# Altium project wius_hardware.PrjPcb
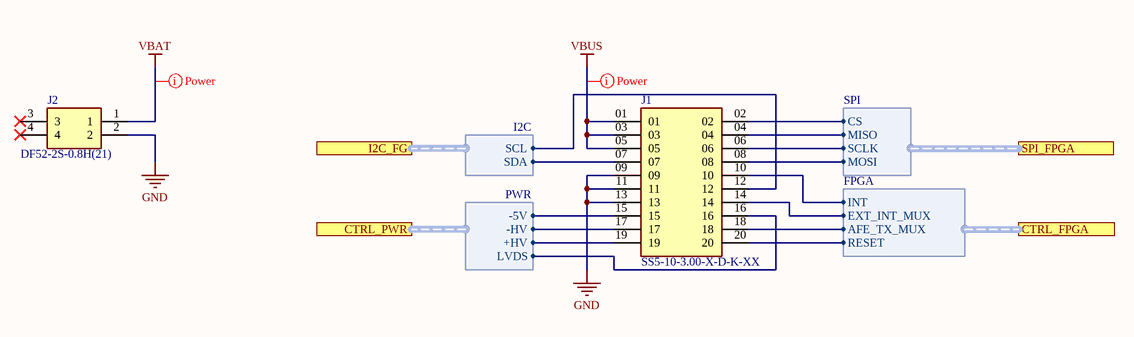
[diagram p0: connectors.SchDoc]
Desc1: High-Throughput, Low-Power WiFi for Wearable Ultrasound Systems; DrawnBy: Cédric Hirschi; FileInfo: =DocumentName; Organization: Integrated Systems Laboratory; ProjectTitle: WiUS; Revision: v1.0
7 sheets, 87 parts. Net scope: flat (ports and power ports of the same name join across sheets).
Board file: wius.PcbDoc
Sheets:
  connectors.SchDoc
  debug_interface.SchDoc
  gap.SchDoc
  power_conversion.SchDoc
  power_rf.SchDoc
  io_a.SchDoc
  io_b.SchDoc

## Sheet connectors.SchDoc: connectors
size A4; SheetNumber: 2; SheetTotal: 11

### Parts
J1  SS5-10-3.00-X-D-K-XX  [SAMTEC_SS5-10-3.00-X-D-K-XX]
J2  DF52-2S-0.8H(21)  [DF522S08H21]

### Ports
CTRL_FPGA (harness FPGA, see main[3B], power_io[5A]), CTRL_PWR (harness PWR, see main[3B], power_io[5A]), I2C_FG (harness I2C, see main[3B], io_b[4B], power_conversion[1A], power_io[6C]), SPI_FPGA (harness SPI, see main[3B], io_a[4C], power_io[6B])

### Harnesses
PWR: -5V, -HV, +HV, LVDS
FPGA: INT, EXT_INT_MUX, AFE_TX_MUX, RESET
SPI: CS, MISO, SCLK, MOSI
I2C: SCL, SDA

### Nets
GND: J1.09 J1.11 J1.13 J2.2
VBAT: J2.1
VBUS: J1.01 J1.03 J1.05
I2C_FG_SCL: J1.12 ; port I2C_FG.SCL
I2C_FG_SDA: J1.07 ; port I2C_FG.SDA
SPI_FPGA_SCLK_BUF: J1.06 ; port SPI_FPGA.SCLK
NetJ1_02: J1.02 ; port SPI_FPGA.CS
NetJ1_04: J1.04 ; port SPI_FPGA.MISO
NetJ1_08: J1.08 ; port SPI_FPGA.MOSI
NetJ1_10: J1.10 ; port CTRL_FPGA.INT
NetJ1_14: J1.14 ; port CTRL_FPGA.EXT_INT_MUX
NetJ1_15: J1.15 ; port CTRL_PWR.-5V
NetJ1_16: J1.16 ; port CTRL_PWR.LVDS
NetJ1_17: J1.17 ; port CTRL_PWR.-HV
NetJ1_18: J1.18 ; port CTRL_FPGA.AFE_TX_MUX
NetJ1_19: J1.19 ; port CTRL_PWR.+HV
NetJ1_20: J1.20 ; port CTRL_FPGA.RESET

Not connected (* = marked no-connect by the designer): J2 3* 4*

### Layout directives
net class Power: VBAT, VBUS

### Notes on the sheet
- Project:
- Laboratory:
- Date:
- File:
- Rev:
- Variation:
- Drawn By:
- Checked By:
- Sheet:
- /

### Library data of the parts
J1 = SS5-10-3.00-X-D-K-XX: 0.50mm Socket Strip Assembly; MF: Samtec Inc.; Availability: Unavailable; MP: SS5-10-3.00-X-D-K-XX; Price: None; Package: None; Value: *
J2 = DF52-2S-0.8H_21_: Connector; Manufacturer_Name: Hirose; Datasheet Link: https://datasheet.datasheetarchive.com/originals/distributors/DKDS-30/591726.pdf; Height: 1mm; Manufacturer_Part_Number: DF52-2S-0.8H(21); Mouser Part Number: 798-DF52-2S-0.8H21; Mouser Price/Stock: https://www.mouser.co.uk/ProductDetail/Hirose-Connector/DF52-2S-0.8H21?qs=%2FKR40Cd6GUpAHUMGMtWbig%3D%3D

## Sheet debug_interface.SchDoc: Debug interface
size A4; SheetNumber: 3; SheetTotal: 11
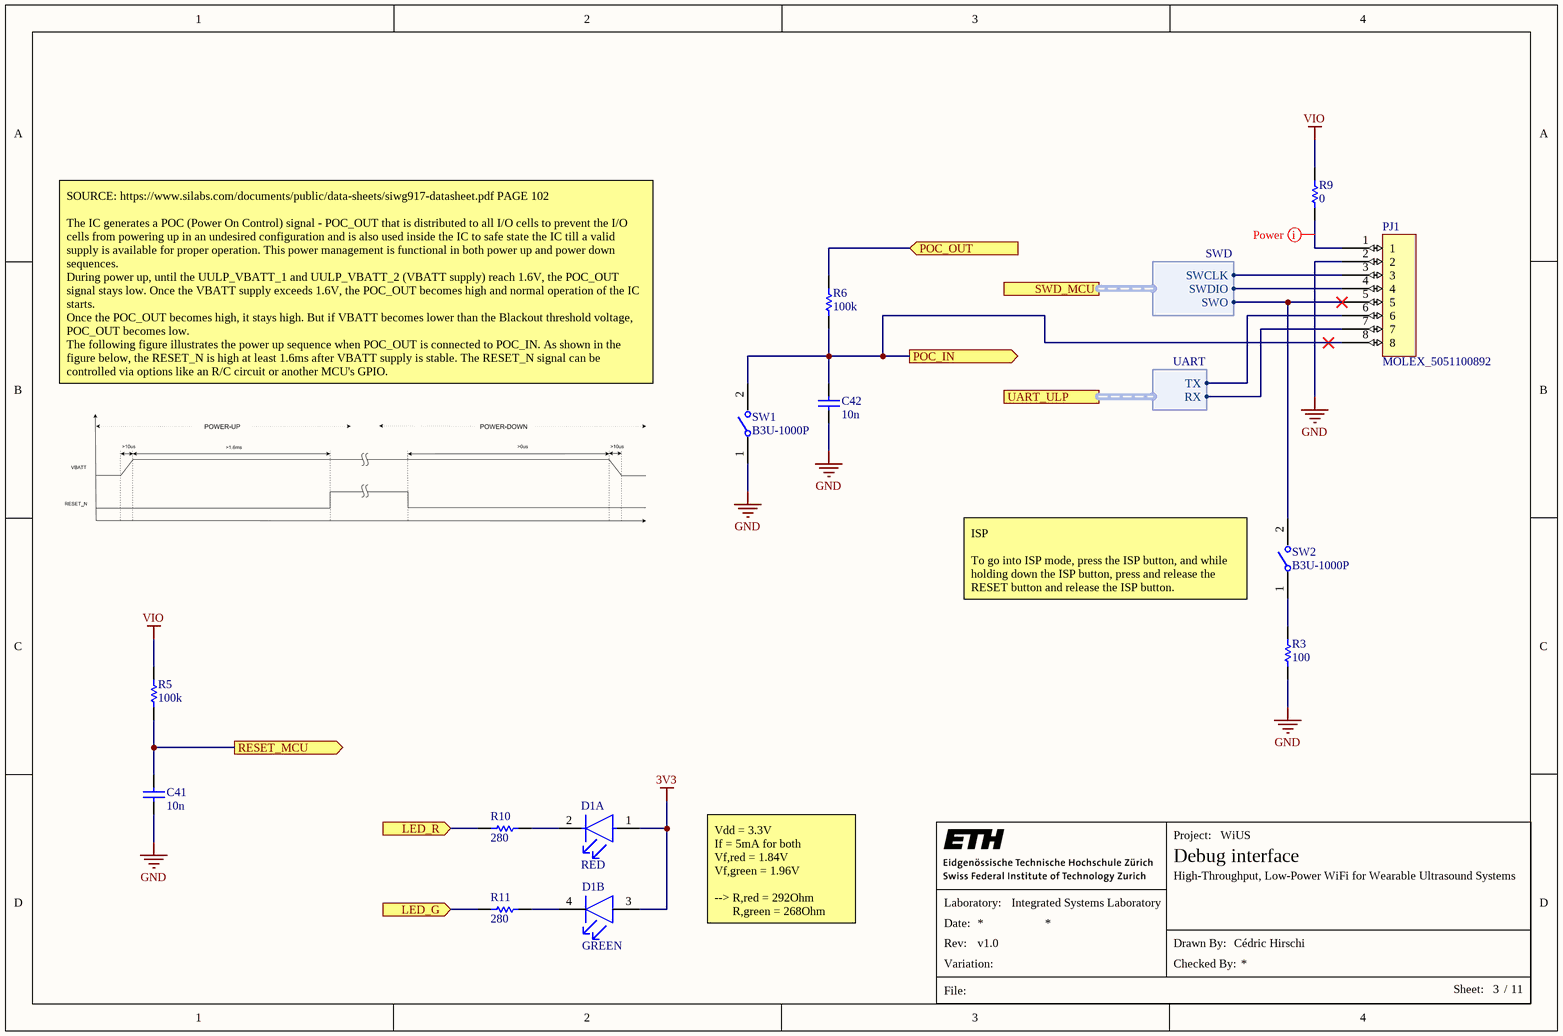
[diagram p1: debug_interface.SchDoc]

### Parts
C41  10n  [CAPC1005X55X25LL05T10]
C42  10n  [CAPC1005X55X25LL05T10]
D1  RED  [FP-APTB1615SURKCGKC-F01-MFG]  (parts A,B of 2)
PJ1  MOLEX_5051100892  [MOLEX_5051100892]
R3  100  [RESC1005X40X25ML05T10]
R5  100k  [RESC1005X40X25NL05T10]
R6  100k  [RESC1005X40X25NL05T10]
R9  value 0  [RESC1005X40X25ML05T10]  (hidden comment: Resistor 0R 0402 63 mW)
R10  280  [RESC1005X40X25NL05T10]
R11  280  [RESC1005X40X25NL05T10]
SW1  B3U-1000P  [FP-B3U-1000P-MFG]
SW2  B3U-1000P  [FP-B3U-1000P-MFG]

### Ports
LED_G (in, see main[3B], io_a[3A], power_io[6B]), LED_R (in, see main[3A], io_a[3A], power_io[6B]), POC_IN (out, see main[3A], power_core[1C], power_io[2B]), POC_OUT (in, see main[3A], power_core[1C], power_io[2B]), RESET_MCU (out, see main[3A], power_core[1C], power_io[2B]), SWD_MCU (harness SWD, see main[3A], io_b[4C], power_io[6C]), UART_ULP (harness UART, see main[3A], io_b[4C], power_io[6C])

### Harnesses
SWD: SWCLK, SWDIO, SWO
UART: RX, TX

### Nets
3V3: D1.1(RED_A) D1.3(GREEN_A)
GND: C41.2 C42.2 PJ1.2 R3.1 SW1.1
VIO: R5.2 R9.2
LED_G: R11.1 ; port LED_G
LED_R: R10.1 ; port LED_R
SWD_SWCLK: PJ1.3 ; port SWD_MCU.SWCLK
SWD_SWDIO: PJ1.4 ; port SWD_MCU.SWDIO
SWD_SWO: PJ1.5 SW2.2 ; port SWD_MCU.SWO
UART_ULP_RX: PJ1.7 ; port UART_ULP.RX
UART_ULP_TX: PJ1.6 ; port UART_ULP.TX
NetC41_1: C41.1 R5.1 ; port RESET_MCU
NetC42_1: C42.1 PJ1.8 R6.1 SW1.2 ; port POC_IN
NetD1_2: D1.2(RED_C) R10.2
NetD1_4: D1.4(GREEN_C) R11.2
NetPJ1_1: PJ1.1 R9.1
NetR3_2: R3.2 SW2.1
NetR6_2: R6.2 ; port POC_OUT

### Layout directives
net class Power: NetPJ1_1

### Notes on the sheet
- SOURCE: https://www.silabs.com/documents/public/data-sheets/siwg917-datasheet.pdf PAGE 102
  The IC generates a POC (Power On Control) signal - POC_OUT that is distributed to all I/O cells to prevent the I/O cells from powering up in an undesired configuration and is also used inside the IC to safe state the IC till a valid supply is available for proper operation. This power management is functional in both power up and power down sequences.
  During power up, until the UULP_VBATT_1 and UULP_VBATT_2 (VBATT supply) reach 1.6V, the POC_OUT signal stays low. Once the VBATT supply exceeds 1.6V, the POC_OUT becomes high and normal operation of the IC starts.
  Once the POC_OUT becomes high, it stays high. But if VBATT becomes lower than the Blackout threshold voltage, POC_OUT becomes low.
  The following figure illustrates the power up sequence when POC_OUT is connected to POC_IN. As shown in the figure below, the RESET_N is high at least 1.6ms after VBATT supply is stable. The RESET_N signal can be controlled via options like an R/C circuit or another MCU's GPIO.
- ISP
  To go into ISP mode, press the ISP button, and while holding down the ISP button, press and release the RESET button and release the ISP button.
- Vdd = 3.3V
  If = 5mA for both
  Vf,red = 1.84V
  Vf,green = 1.96V
  --> R,red = 292Ohm
  R,green = 268Ohm
- Project:
- Laboratory:
- Date:
- File:
- Rev:
- Variation:
- Drawn By:
- Checked By:
- Sheet:
- /

### Library data of the parts
C41 C42 = CMP-1034-01880-2: Manufacturer: Murata; Part Number: GRM155R71E103KA01D
D1 = CMP-44529-000005-1: LED GREEN/RED CLEAR CHIP SMD; Manufacturer: Kingbright; Manufacturer Part Number: APTB1615SURKCGKC-F01; Reverse Voltage: 5V; Viewing Angle: 150°; Max Junction Temp: +115°C; Led Orientation: Top View; Wavelength: 630/570nm; Colour: Red, Green; Forward Voltage: 1.95/2.1V; Peak Emmision Wavelength: 645/574nm; Power Dissipation: 75mW; Forward Current: 20mA; Luminous Intensity: 200/50mcd; Temperature Range High: +85°C; Temperature: -40°C to +85°C; Digikey Description: LED GREEN/RED CLEAR CHIP SMD; RoHS: TRUE; Automotive: No; Octopart: https://octopart.com/aptb1615surkcgkc-f01-kingbright-5355651; Temperature Range Low: -40°C; Device Class L3: unset; ComponentLink2Description: Datasheet; Device Class L1: Optoelectronics; Height: 0.9mm; ComponentLink2URL: http://www.kingbrightusa.com/images/catalog/SPEC/APTB1615SURKCGKC-F01.pdf; Category: Diode; Package: APTB1615SURKCGKC-F01; Device Class L2: LEDs; Lead Free: Yes
R3 = CMP-2002-07344-1: Part Number: RC0402FR-07100RL; Manufacturer: Yageo / Phycomp
R5 R6 = CMP-2002-07343-1: Part Number: RC0402FR-07100KL; Manufacturer: Yageo / Phycomp
R9 = CMP-009-00004-5: Chip Resistor, 0 Ohm, 0.063 W, -55 to 155 degC, 0402 (1005 Metric); Power: 63mW; Voltage Rating: 50V; Max Operating Temperature: 155°C; Pins: 2; RoHS Compliant: True; Min Operating Temperature: -55°C; Mounting Technology: SM; Case/Package: 0402
R10 R11 = CMP-1011-00446-2: Manufacturer: Yageo; Part Number: RC0402FR-07280RL
SW1 SW2 = CMP-2100-03586-2: SWITCH TACTILE SPST-NO 0.05A 12V; Contact Resistance: 100mR; Operating Force: 1.5N; Max Current Rating: 50mA; Switch Travel: 0.15mm; Actuator Type: Standard; Mechanical Life: 200000Cycles; Ratings: Dust Proof; Illumination Type: Non-Illuminated; Throw Configuration: SPST; Actuator Length: 0.4mm; Switch Function: Off-Mom; Height: 1.2mm; Width: 3mm; Weight: 0.000776oz; Contact Material: Silver; Max Voltage Rating (DC): 12V; Insulation Resistance: 100MR; Lead Free: Lead Free; Current Rating: 50mA; Termination: SMD/SMT; Length: 4mm; Voltage Rating (DC): 12V; Contact Current Rating: 50mA; Orientation: Straight; Depth: 2.5mm; Max Operating Temperature: 70°C; Packaging: Tape and Reel; Min Operating Temperature: -25°C; Package Quantity: 1; Mount: Surface Mount; Electrical Life: 200000Cycles

## Sheet gap.SchDoc: GAPMod
size A4; SheetNumber: 4; SheetTotal: 11
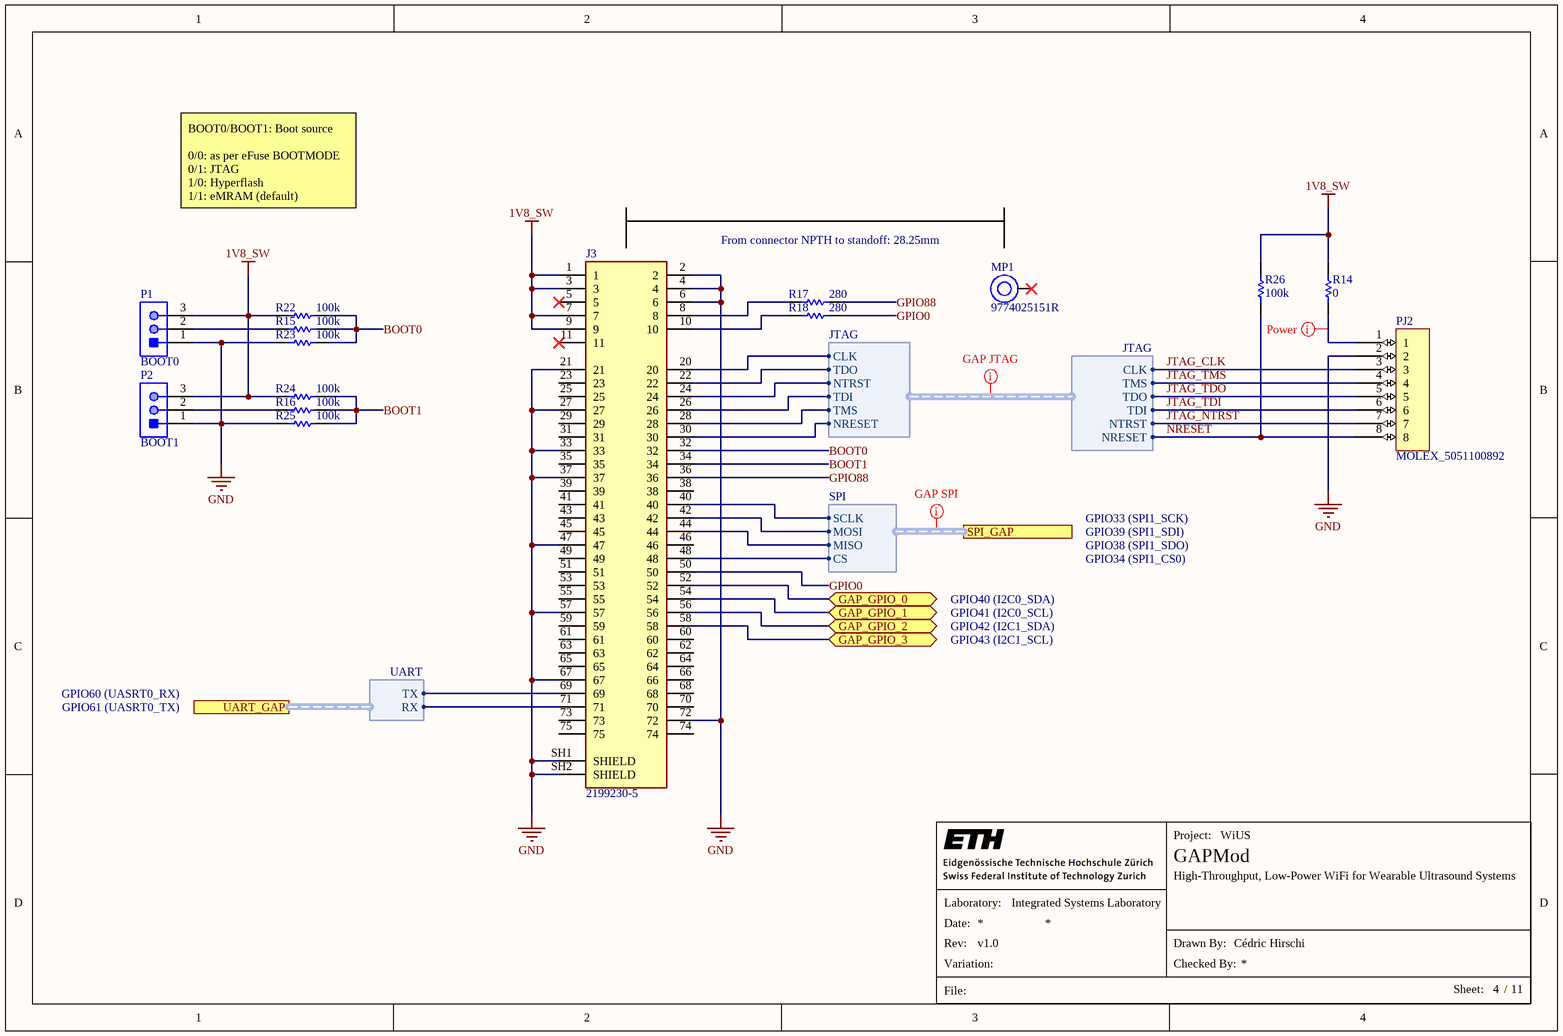
[diagram p2: gap.SchDoc]

### Parts
J3  2199230-5  [TE_2199230-5]
MP1  9774025151R  [9774025151]
P1  BOOT0  [SLIN-GRPB031VWVN-RC_V]
P2  BOOT1  [SLIN-GRPB031VWVN-RC_V]
PJ2  MOLEX_5051100892  [MOLEX_5051100892]
R14  value 0  [RESC1005X40X25ML05T10]  (hidden comment: Resistor 0R 0402 63 mW)
R15  100k  [RESC1005X40X25NL05T10]
R16  100k  [RESC1005X40X25NL05T10]
R17  280  [RESC1005X40X25NL05T10]
R18  280  [RESC1005X40X25NL05T10]
R22  100k  [RESC1005X40X25NL05T10]
R23  100k  [RESC1005X40X25NL05T10]
R24  100k  [RESC1005X40X25NL05T10]
R25  100k  [RESC1005X40X25NL05T10]
R26  100k  [RESC1005X40X25NL05T10]

### Ports
GAP_GPIO_0 (bidir, see main[6B], io_a[3B], power_io[6B]), GAP_GPIO_1 (bidir, see main[6B], io_a[3B], power_io[6B]), GAP_GPIO_2 (bidir, see main[6B], io_a[3B], power_io[6B]), GAP_GPIO_3 (bidir, see main[6B], io_a[3B], power_io[6B]), SPI_GAP (harness SPI, see main[6B], io_a[3B], power_io[6B]), UART_GAP (harness UART, see main[6B], io_a[3B], power_io[6B])

### Harnesses
SPI: SCLK, MISO, MOSI, CS
JTAG: CLK, TDO, NTRST, TDI, TMS, NRESET
UART: TX, RX

### Nets
1V8_SW: J3.1 J3.3 J3.7 J3.9 P1.3 P2.3 R14.2 R22.2 R24.2 R26.2
GND: J3.2 J3.4 J3.6 J3.21 J3.27 J3.33 J3.37 J3.47 J3.57 J3.67 J3.72 J3.SH1(SHIELD) J3.SH2(SHIELD) P1.1 P2.1 PJ2.2 R23.2 R25.2
BOOT0: J3.32 R15.1 R22.1 R23.1
BOOT1: J3.34 R16.1 R24.1 R25.1
GAP_GPIO_0: J3.52 ; port GAP_GPIO_0
GAP_GPIO_1: J3.54 ; port GAP_GPIO_1
GAP_GPIO_2: J3.56 ; port GAP_GPIO_2
GAP_GPIO_3: J3.58 ; port GAP_GPIO_3
GPIO0: J3.50 R18.2
GPIO88: J3.36 R17.2
JTAG_CLK: J3.20 PJ2.3 ; harness JTAG.CLK
JTAG_NTRST: J3.24 PJ2.7 ; harness JTAG.NTRST
JTAG_TDI: J3.26 PJ2.6 ; harness JTAG.TDI
JTAG_TDO: J3.22 PJ2.5 ; harness JTAG.TDO
JTAG_TMS: J3.28 PJ2.4 ; harness JTAG.TMS
NRESET: J3.30 PJ2.8 R26.1 ; harness JTAG.NRESET
SPI_GAP_CS: J3.48 ; port SPI_GAP.CS
SPI_GAP_MISO: J3.44 ; port SPI_GAP.MISO
SPI_GAP_MOSI: J3.42 ; port SPI_GAP.MOSI
SPI_GAP_SCLK: J3.40 ; port SPI_GAP.SCLK
UART_GAP_RX: J3.71 ; port UART_GAP.RX
UART_GAP_TX: J3.69 ; port UART_GAP.TX
NetJ3_8: J3.8 R17.1
NetJ3_10: J3.10 R18.1
NetP1_2: P1.2 R15.2
NetP2_2: P2.2 R16.2
NetPJ2_1: PJ2.1 R14.1

Not connected (* = marked no-connect by the designer): J3 5* 11* 23 25 29 31 35 38 39 41 43 45 46 49 51 53 55 59 60 61 62 63 64 65 66 68 70 73 74 75; MP1 1*

### Layout directives
net class Power: NetPJ2_1
net class JTAG_GAP: (no net found under the mark)
net class SPI_GAP: (no net found under the mark)

### Notes on the sheet
- BOOT0/BOOT1: Boot source
  0/0: as per eFuse BOOTMODE
  0/1: JTAG
  1/0: Hyperflash
  1/1: eMRAM (default)
- From connector NPTH to standoff: 28.25mm
- GPIO33 (SPI1_SCK)
- GPIO39 (SPI1_SDI)
- GPIO38 (SPI1_SDO)
- GPIO34 (SPI1_CS0)
- GPIO40 (I2C0_SDA)
- GPIO41 (I2C0_SCL)
- GPIO42 (I2C1_SDA)
- GPIO43 (I2C1_SCL)
- GPIO60 (UASRT0_RX)
- GPIO61 (UASRT0_TX)
- Project:
- Laboratory:
- Date:
- File:
- Rev:
- Variation:
- Drawn By:
- Checked By:
- Sheet:
- /

### Library data of the parts
J3 = 2199230-5: Conn Card Edge 67 POS 0.5mm Solder RA SMD Embossed T/R; MF: {'manufacturer': u'TE Connectivity'}; Package: None; Price: None; Value: *; MP: 2199230-5; Availability: Unavailable
MP1 = CMP-03913-59774856-1: 9774025151R Spacer Material: Steel Mounting: SMT Series: WA-SMSI Thread D: M2.5; Plating: Tin; Threaded/Unthreaded: Threaded; Outside Diameter: 5.1054mm; REACH SVHC: Unknown; Packaging: Tape and Reel; Height: 2.6mm; Min Operating Temperature: -55°C; NexarPartId: 59774856; Max Operating Temperature: 150°C; RoHS: Compliant; Length: 2.5mm; Material: Steel
P1 P2 = CMP-2000-06372-1: Male Header, Pitch 1.27 mm, 1 x 3 Position, Height 4 mm, Tail Length 2.3 mm, -40 to 105 degC, RoHS, Bulk; Manufacturer: Sullins; Other Names: S9014E-03; Number of Positions: 3; Connector Type: Header,Unshrouded; Pitch: 0.050"(1.27mm); Dynamic Catalog: GRPB; Catalog Drawings: S9014ESeriesTop; Mating Products: S9010E-03-ND / -CONNHEADER.050"3POSR/APCB / S9008E-03-ND / -CONNHEADER.050"3POSPCBGOLD / S9005E-03-ND / -CONNHEADER.050"3POSSMDGOLD; Number of Positions Loaded: All; Contact Finish: Gold; Mounting Type: ThroughHole; Termination: Solder; Packaging: Bulk; Category: Connectors,Interconnects; Package Description: Male Header, Pitch 1.27 mm, 1 x 3 Position, Height 4 mm, Tail Length 2.3 mm; Standard Package: 1; Datasheet URL: http://www.sullinscorp.com/drawings/71_GRPB___1VWVN-RC,_10957-C.pdf; Package Reference: GRPB031VWVN-RC; Family: RectangularConnectors-Headers,MalePins; Number of Rows: 1; Contact Type: MalePin; Manufacturer URL: http://www.sullinscorp.com/; Mounting Technology: ThroughHole; Contact Mating Length: 0.118"(3.00mm); Contact Finish Thickness: Flash; Datasheet Version: Rev. C, 12/2008
R14 = CMP-009-00004-5: as R9 on sheet debug_interface; Max Operating Temperature: 155°C; Pins: 2; RoHS Compliant: True; Min Operating Temperature: -55°C; Mounting Technology: SM; Case/Package: 0402
R15 R16 R22-R26 = CMP-2002-07343-1: as R5 on sheet debug_interface
R17 R18 = CMP-1011-00446-2: as R10 on sheet debug_interface

## Sheet power_conversion.SchDoc: Power conversion
size A4; SheetNumber: 5; SheetTotal: 11
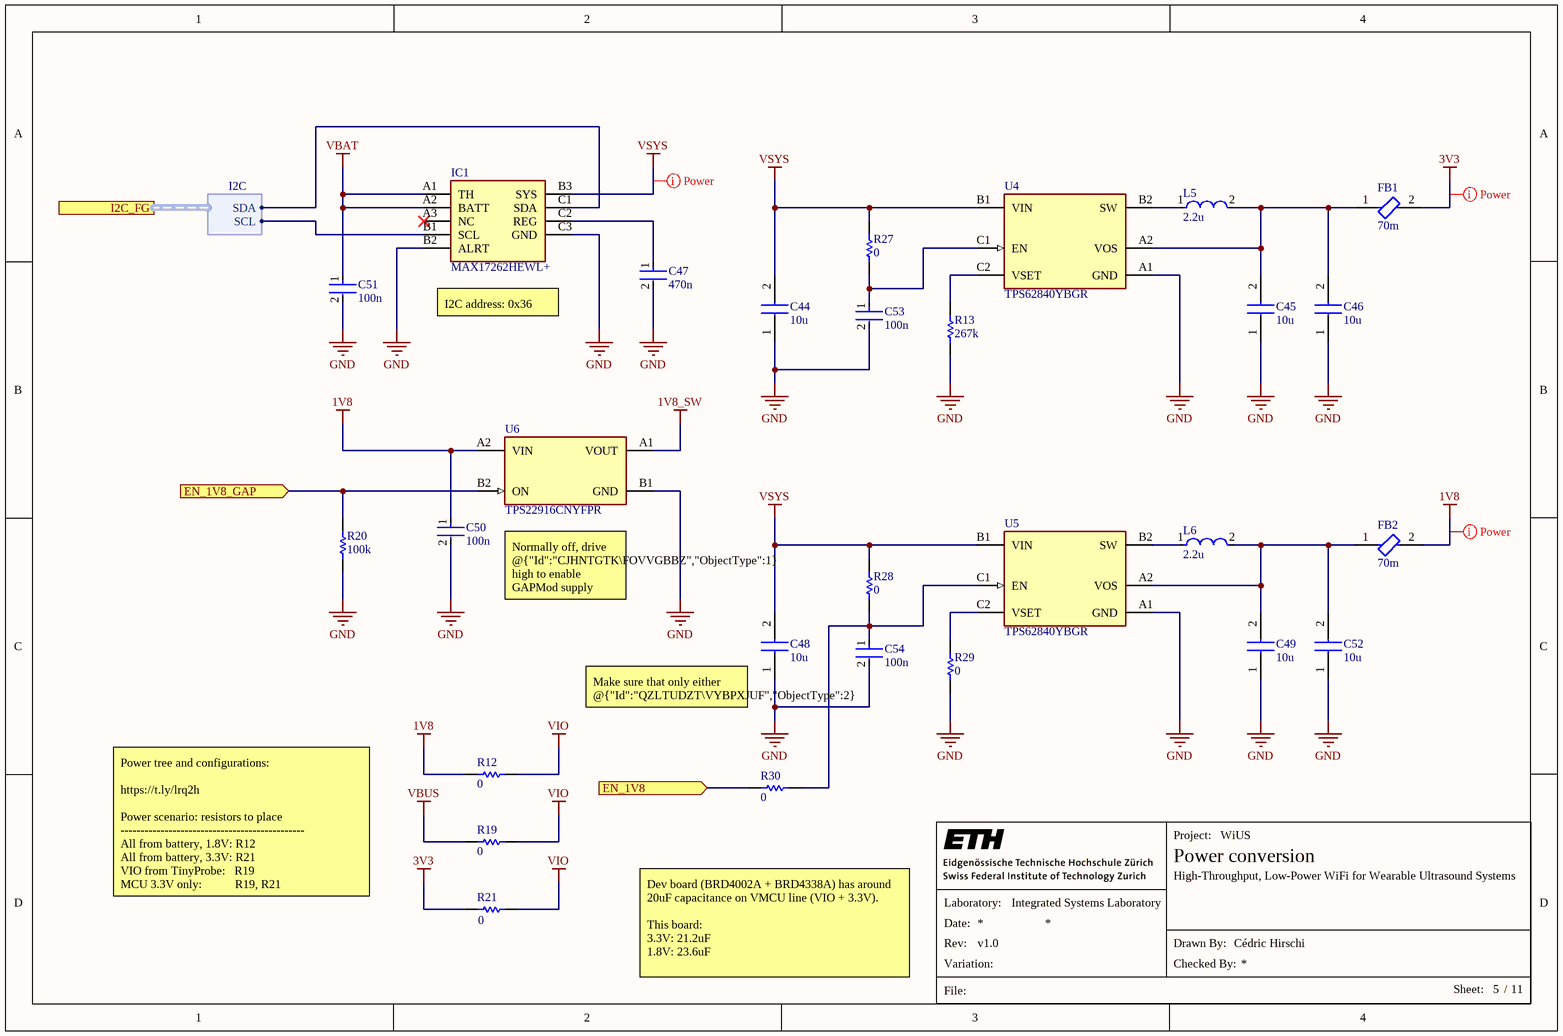
[diagram p3: power_conversion.SchDoc]

### Parts
C44  10u  [CAPC1608X100N]
C45  10u  [CAPC1608X100N]
C46  10u  [CAPC1608X100N]
C47  470n  [FP-GRM15-0_1-MFG]
C48  10u  [CAPC1608X100N]
C49  10u  [CAPC1608X100N]
C50  100n  [FP-GRT155-0_05-MFG]
C51  100n  [FP-GRT155-0_05-MFG]
C52  10u  [CAPC1608X100N]
C53  100n  [FP-GRT155-0_05-MFG]
C54  100n  [FP-GRT155-0_05-MFG]
FB1  70m  [FP-BLM15-0_05-MFG]
FB2  70m  [FP-BLM15-0_05-MFG]
IC1  MAX17262HEWL+  [BGA9C40P3X3_153X153X69]
L5  2.2u  [FP-DFE201612C-MFG]
L6  2.2u  [FP-DFE201612C-MFG]
R12  value 0  [RESC1005X40X25ML05T10]  (hidden comment: Resistor 0R 0402 63 mW)
R13  267k  [RESC1005X40X25LL05T10]
R19  value 0  [RESC1005X40X25ML05T10]  (hidden comment: Resistor 0R 0402 63 mW)
R20  100k  [RESC1005X40X25NL05T10]
R21  value 0  [RESC1005X40X25ML05T10]  (hidden comment: Resistor 0R 0402 63 mW)
R27  value 0  [RESC1005X40X25ML05T10]  (hidden comment: Resistor 0R 0402 63 mW)
R28  value 0  [RESC1005X40X25ML05T10]  (hidden comment: Resistor 0R 0402 63 mW)
R29  value 0  [RESC1005X40X25ML05T10]  (hidden comment: Resistor 0R 0402 63 mW)
R30  value 0  [RESC1005X40X25ML05T10]  (hidden comment: Resistor 0R 0402 63 mW)
U4  TPS62840YBGR  [FP-YBG0006-MFG]
U5  TPS62840YBGR  [FP-YBG0006-MFG]
U6  TPS22916CNYFPR  [FP-YFP0004-IPC_C]

### Ports
EN_1V8 (in, see main[4C], io_a[3B], power_io[6B]), EN_1V8_GAP (in, see main[4C], io_a[3B], power_io[6B]), I2C_FG (harness I2C, see main[4C], connectors[2B], io_b[4B], power_io[6C])

### Harnesses
I2C: SDA, SCL

### Nets
1V8: C50.1 FB2.2 R12.2 U6.A2(VIN)
1V8_SW: U6.A1(VOUT)
3V3: FB1.2 R21.1
GND: C44.1 C45.1 C46.1 C47.2 C48.1 C49.1 C50.2 C51.2 C52.1 C53.2 C54.2 IC1.B2(ALRT) IC1.C3(GND) R13.1 R20.1 R29.2 U4.A1(GND) U5.A1(GND) U6.B1(GND)
VBAT: C51.1 IC1.A1(TH) IC1.A2(BATT)
VBUS: R19.2
VIO: R12.1 R19.1 R21.2
VSYS: C44.2 C48.2 IC1.B3(SYS) R27.1 R28.1 U4.B1(VIN) U5.B1(VIN)
EN_1V8: R30.1 ; port EN_1V8
EN_1V8_GAP: R20.2 U6.B2(ON) ; port EN_1V8_GAP
I2C_FG_SCL: IC1.B1(SCL) ; port I2C_FG.SCL
I2C_FG_SDA: IC1.C1(SDA) ; port I2C_FG.SDA
NetC45_2: C45.2 C46.2 FB1.1 L5.2 U4.A2(VOS)
NetC47_1: C47.1 IC1.C2(REG)
NetC49_2: C49.2 C52.2 FB2.1 L6.2 U5.A2(VOS)
NetC53_1: C53.1 R27.2 U4.C1(EN)
NetC54_1: C54.1 R28.2 R30.2 U5.C1(EN)
NetL5_1: L5.1 U4.B2(SW)
NetL6_1: L6.1 U5.B2(SW)
NetR13_2: R13.2 U4.C2(VSET)
NetR29_1: R29.1 U5.C2(VSET)

Not connected (* = marked no-connect by the designer): IC1 A3(NC)*

### Layout directives
net class Power: 1V8, 3V3, VSYS

### Notes on the sheet
- (near IC1) I2C address: 0x36
- Normally off, drive @{"Id":"CJHNTGTK\FOVVGBBZ","ObjectType":1} high to enable GAPMod supply
- (near C48) Make sure that only either @{"Id":"QZLTUDZT\VYBPXJUF","ObjectType":2} or @{"Id":"QZLTUDZT\XKOCDFZE","ObjectType":2} is mounted
- Power tree and configurations:
  https://t.ly/lrq2h
  Power scenario: resistors to place
  ----------------------------------------------
  All from battery, 1.8V: R12
  All from battery, 3.3V: R21
  VIO from TinyProbe:   R19
  MCU 3.3V only:           R19, R21
- Dev board (BRD4002A + BRD4338A) has around 20uF capacitance on VMCU line (VIO + 3.3V).
  This board:
  3.3V: 21.2uF
  1.8V: 23.6uF
- Project:
- Laboratory:
- Date:
- File:
- Rev:
- Variation:
- Drawn By:
- Checked By:
- Sheet:
- /

### Library data of the parts
C44-C46 C48 C49 C52 = GMC10X7R106K10NT: Cap Cer 10UF 10V X7R 0603; Manufacturer_Name: Cal-Chip; Datasheet Link: https://88ce57.p3cdn1.secureserver.net/wp-content/uploads/2023/01/gmc_series-2.pdf; Height: 1mm; Manufacturer_Part_Number: GMC10X7R106K10NT; Supplier 1: Digikey; Supplier Part Number 1: 4713-GMC10X7R106K10NTCT-ND
C47 = CMP-2000-05009-2: CAP CER 0.47UF 10V X5R 0402; Manufacturer: Murata Electronics North America; Manufacturer Part Number: GRM155R61A474KE15D; Temperature Coefficient: 15%; Material: Ceramic; Tolerance: 10%; Device Class L3: Ceramic Capacitors; ComponentLink2Description: Datasheet; ComponentLink2URL: https://search.murata.co.jp/Ceramy/image/img/A01X/G101/ENG/GRM155R61A474KE15-01A.pdf; Package: GRM15-0.1; Voltage Rating: 10V; Capacitance: 0.47uF; Category: Cap; Temperature Range High: +85°C; Temperature Range Low: -55°C; Height: 0.55mm; Device Class L2: Capacitors; Lead Free: Yes; Mouser Description: Multilayer Ceramic Capacitors MLCC - SMD/SMT 0402 0.47uF 10volts X5R 10%; Ipc Land Pattern Name: CAPC10050X50; Temperature Characteristic: X5R; Digikey Description: CAP CER 0.47UF 10V X5R 0402; Value: 0.47uF; Octopart: https://octopart.com/grm155r61a474ke15d-murata-196883; Automotive: No; Device Class L1: Passive Components; Temperature: -55°C to +85°C; RoHS: TRUE
C50 C51 C53 C54 = CMP-06035-014200-1: Multi-Layer Ceramic Capacitor 100nF 50V X7R ±10% 0402 Paper T/R
FB1 FB2 = CMP-0686-00284-4: Chip Ferrite Bead, 0402, 80Ω @ 100MHz, 0.07Ω, 25%, 1.5A; Number of Lines: 1; DC Resistance-Max: 70mR; Impedance: 80R; Height: 0.5mm; Package Quantity: 1; RoHS Compliant: Yes; Max Operating Temperature: 125°C; Depth: 0.5mm; Max Current Rating: 1.5A; Max DC Current: 1.5A; Current Rating: 1.5A; Number of Pins: 2; Case Code (Imperial): 0402; Case/Package: 0402; Case Code (Metric): 1005; Material: Ferrite; Packaging: Tape and Reel; REACH SVHC: No SVHC; Length: 1mm; Tolerance: 25%; Termination: SMD/SMT; Series: BLM15PD; Number of Circuits: 1; Test Frequency: 100MHz; DC Resistance (DCR): 70mR; Min Operating Temperature: -55°C; Lead Free: Lead Free; Width: 0.5mm
IC1 = MAX17262HEWL+: Integrated Circuit; Manufacturer_Name: Analog Devices; Datasheet Link: https://www.analog.com/MAX17262/datasheet; Height: 0.69mm; Manufacturer_Part_Number: MAX17262HEWL+
L5 L6 = CMP-06042-009962-1: Shielded Wirewound Inductor 2.2uH 20% 1800mA 0.116Ω 0806 (2016)
R12 R19 R21 R27-R30 = CMP-009-00004-5: as R9 on sheet debug_interface; Max Operating Temperature: 155°C; Pins: 2; RoHS Compliant: True; Min Operating Temperature: -55°C; Mounting Technology: SM; Case/Package: 0402
R13 = CMP-2002-07544-1: Manufacturer: Yageo; Part Number: RC0402FR-07267KL
R20 = CMP-2002-07343-1: as R5 on sheet debug_interface
U4 U5 = CMP-04918-000401-1: ULTRA LOW IQ BUCK CONVERTER
U6 = CMP-04910-000105-1: IC PWR SWITCH P-CHAN 1:1 4DSBGA; Max Output Current: 2A; Number of Outputs: 1; Fault Protection: Reverse Current; Output Configuration: High Side; RoHS Compliant: Yes; Min Operating Temperature: -40°C; Packaging: Cut Tape; Number of Channels: 1; Max Operating Temperature: 85°C

## Sheet power_rf.SchDoc: RF power conversion
size A4; SheetNumber: 8; SheetTotal: 11
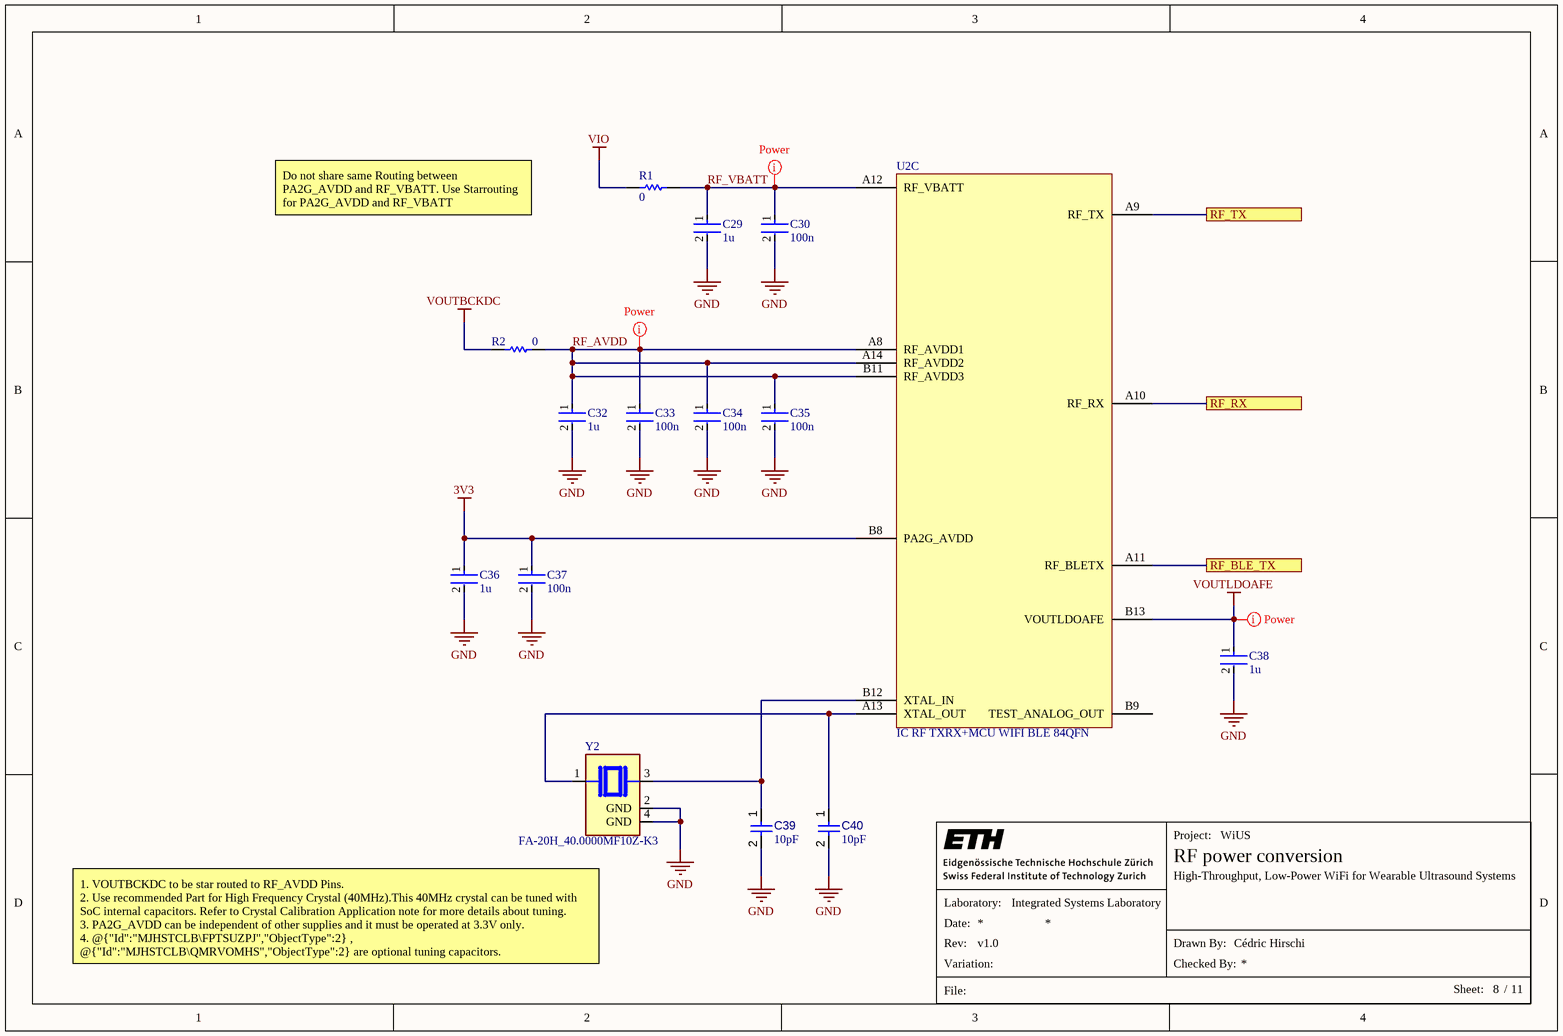
[diagram p4: power_rf.SchDoc]

### Parts
C29  1u  [FP-GRM155-0_05-MFG]
C30  100n  [FP-GRT155-0_05-MFG]
C32  1u  [FP-GRM155-0_05-MFG]
C33  100n  [FP-GRT155-0_05-MFG]
C34  100n  [FP-GRT155-0_05-MFG]
C35  100n  [FP-GRT155-0_05-MFG]
C36  1u  [FP-GRM155-0_05-MFG]
C37  100n  [FP-GRT155-0_05-MFG]
C38  1u  [FP-GRM155-0_05-MFG]
C39  value 10pF  [CAPC1005X55X30LL05T10]  (hidden comment: Capacitor 10 pF +/- 0.25 pF 50 V 0402)
C40  value 10pF  [CAPC1005X55X30LL05T10]  (hidden comment: Capacitor 10 pF +/- 0.25 pF 50 V 0402)
R1  value 0  [RESC1005X40X25ML05T10]  (hidden comment: Resistor 0R 0402 63 mW)
R2  value 0  [RESC1005X40X25ML05T10]  (hidden comment: Resistor 0R 0402 63 mW)
U2  IC RF TXRX+MCU WIFI BLE 84QFN  [SIWG917M110LGTBA]  (part C of 4)
Y2  FA-20H_40.0000MF10Z-K3  [XTAL_FA-20H_40.0000MF10Z-K3]

### Ports
RF_BLE_TX (see power_io[3C], power_io[2C], rf_clocks[4A]), RF_RX (see power_io[3C], power_io[2C], rf_clocks[4B]), RF_TX (see power_io[3C], power_io[2C], rf_clocks[4B])

### Nets
3V3: C36.1 C37.1 U2.B8(PA2G_AVDD)
GND: C29.2 C30.2 C32.2 C33.2 C34.2 C35.2 C36.2 C37.2 C38.2 C39.2 C40.2 Y2.2(GND) Y2.4(GND)
VIO: R1.1
VOUTBCKDC: R2.1
VOUTLDOAFE: C38.1 U2.B13(VOUTLDOAFE)
RF_AVDD: C32.1 C33.1 C34.1 C35.1 R2.2 U2.A8(RF_AVDD1) U2.A14(RF_AVDD2) U2.B11(RF_AVDD3)
RF_VBATT: C29.1 C30.1 R1.2 U2.A12(RF_VBATT)
NetC39_1: C39.1 U2.B12(XTAL_IN) Y2.3
NetC40_1: C40.1 U2.A13(XTAL_OUT) Y2.1
NetU2_A9: U2.A9(RF_TX) ; port RF_TX
NetU2_A10: U2.A10(RF_RX) ; port RF_RX
NetU2_A11: U2.A11(RF_BLETX) ; port RF_BLE_TX

Not connected (* = marked no-connect by the designer): U2 B9(TEST_ANALOG_OUT)

### Layout directives
net class Power: RF_AVDD, RF_VBATT, VOUTLDOAFE

### Notes on the sheet
- Do not share same Routing between PA2G_AVDD and RF_VBATT. Use Starrouting for PA2G_AVDD and RF_VBATT
- (near Y2) 1. VOUTBCKDC to be star routed to RF_AVDD Pins.
  2. Use recommended Part for High Frequency Crystal (40MHz).This 40MHz crystal can be tuned with SoC internal capacitors. Refer to Crystal Calibration Application note for more details about tuning.
  3. PA2G_AVDD can be independent of other supplies and it must be operated at 3.3V only.
  4. @{"Id":"MJHSTCLB\FPTSUZPJ","ObjectType":2} , @{"Id":"MJHSTCLB\QMRVOMHS","ObjectType":2} are optional tuning capacitors.
  5. @{"Id":"MJHSTCLB\IOXMTIAC","ObjectType":2} , @{"Id":"MJHSTCLB\BRJDNKUM","ObjectType":2} are placeholder components for power supply noise filtering purpose.
- Project:
- Laboratory:
- Date:
- File:
- Rev:
- Variation:
- Drawn By:
- Checked By:
- Sheet:
- /

### Library data of the parts
C29 C32 C36 C38 = CMP-06035-025126-1: Chip Multilayer Ceramic Capacitors for General Purpose, 0402, 1.0uF, X6S, 22%, 10%, 16V; Capacitance: 1uF; Thickness: 500um; Voltage Rating (DC): 16V; Tolerance: 10%; Width: 500um; Length: 1mm; Dielectric: X6S
C30 C33-C35 C37 = CMP-06035-014200-1: as C50 on sheet power_conversion
C39 C40 = CMP-001-00011-6: Chip Capacitor, 10 pF, +/- 0.25 pF, 50 V, 0402 (1005 Metric); Voltage Rating: 50V; Tolerance: 0.25%; Capacitor Type: Ceramic; Mounting Technology: SM; Pins: 2; Case/Package: 0402; Min Operating Temperature: -55°C; RoHS Compliant: True; Max Operating Temperature: 125°C
R1 R2 = CMP-009-00004-5: as R9 on sheet debug_interface; Max Operating Temperature: 155°C; Pins: 2; RoHS Compliant: True; Min Operating Temperature: -55°C; Mounting Technology: SM; Case/Package: 0402
U2 = SIWG917
Y2 = FA-20H_40.0000MF10Z-K3: MF: {'manufacturer': u'EPSON'}; MP: FA-20H 40.0000MF10Z-K3; Package: None; Price: None; Value: *; Availability: Unavailable; Supplier 1: Future Electronics; Supplier Part Number 1: 6169727

## Sheet io_a.SchDoc: I/O bank A
size A4; SheetNumber: 9; SheetTotal: 11
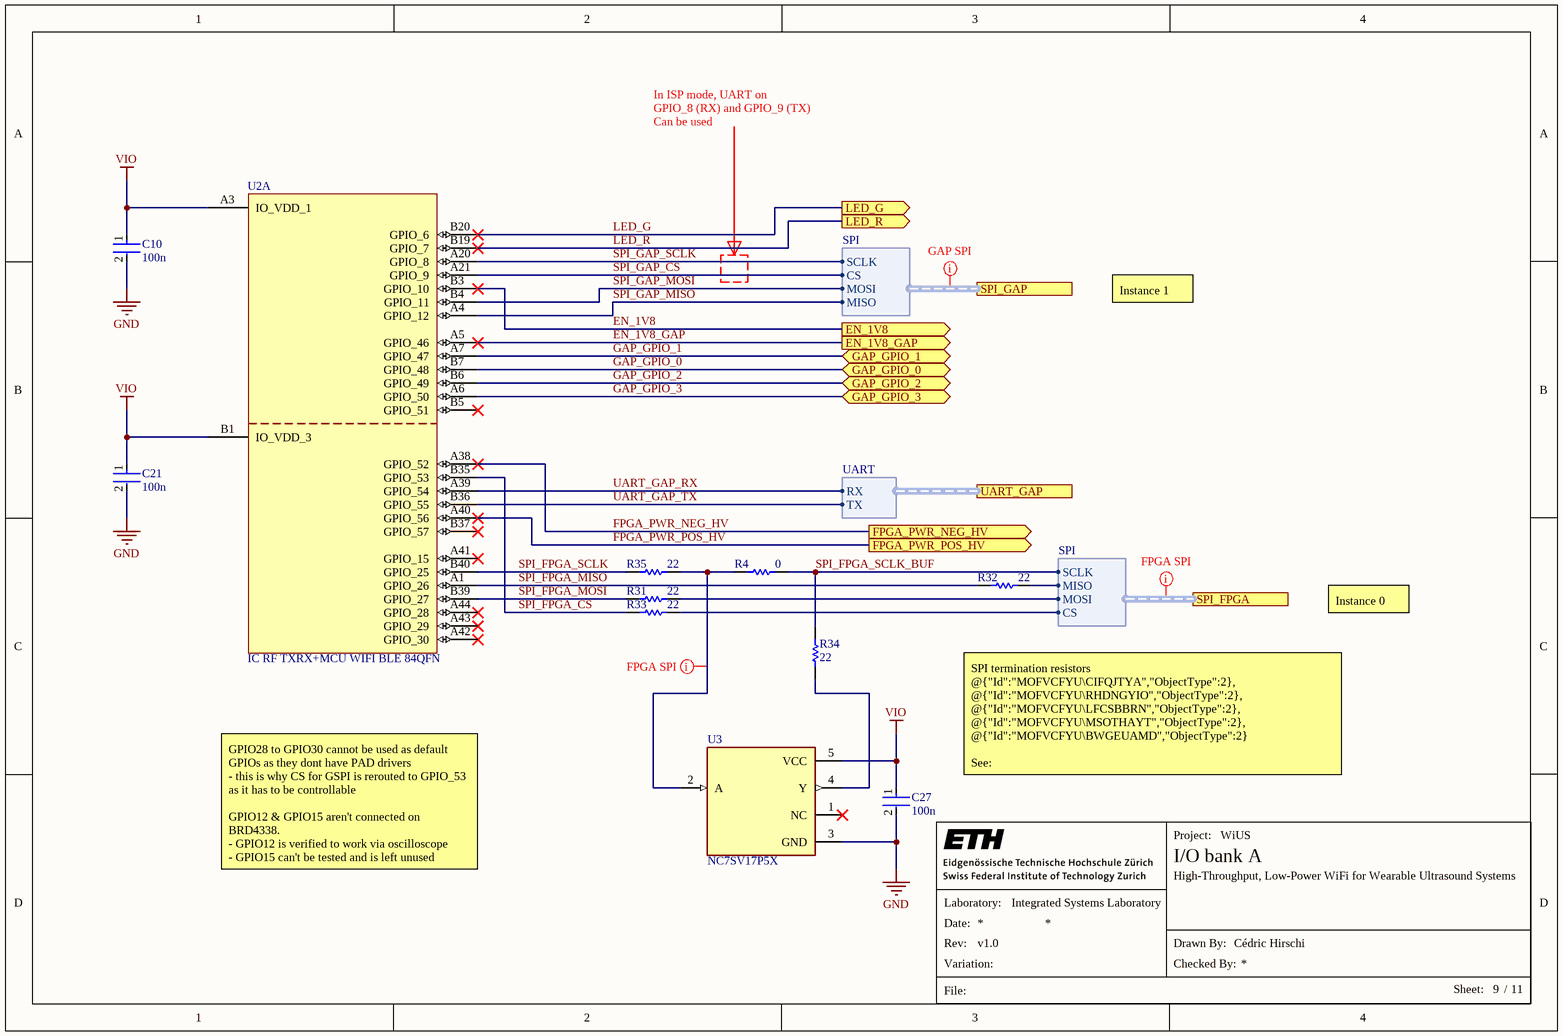
[diagram p5: io_a.SchDoc]

### Parts
C10  100n  [FP-GRT155-0_05-MFG]
C21  100n  [FP-GRT155-0_05-MFG]
C27  100n  [FP-GRT155-0_05-MFG]
R4  value 0  [RESC1005X40X25ML05T10]  (hidden comment: Resistor 0R 0402 63 mW)
R31  22  [RESC1005X40X25LL05T10]
R32  22  [RESC1005X40X25LL05T10]
R33  22  [RESC1005X40X25LL05T10]
R34  22  [RESC1005X40X25LL05T10]
R35  22  [RESC1005X40X25LL05T10]
U2  IC RF TXRX+MCU WIFI BLE 84QFN  [SIWG917M110LGTBA]  (part A of 4)
U3  NC7SV17P5X  [SOT65P210X110-5N]

### Ports
EN_1V8 (out, see power_io[6B], power_conversion[2D], power_io[6B]), EN_1V8_GAP (out, see power_io[6B], power_conversion[1B], power_io[6B]), FPGA_PWR_NEG_HV (out, see power_io[6B]), FPGA_PWR_POS_HV (out, see power_io[6B]), GAP_GPIO_0 (bidir, see power_io[6B], gap[3C], power_io[6B]), GAP_GPIO_1 (bidir, see power_io[6B], gap[3C], power_io[6B]), GAP_GPIO_2 (bidir, see power_io[6B], gap[3C], power_io[6B]), GAP_GPIO_3 (bidir, see power_io[6B], gap[3C], power_io[6B]), LED_G (out, see power_io[6B], debug_interface[1D], power_io[6B]), LED_R (out, see power_io[6B], debug_interface[1D], power_io[6B]), SPI_FPGA (harness SPI, see power_io[6B], connectors[4B], power_io[6B]), SPI_GAP (harness SPI, see power_io[6B], gap[3C], power_io[6B]), UART_GAP (harness UART, see power_io[6B], gap[1C], power_io[6B])

### Harnesses
SPI: SCLK, MISO, MOSI, CS
UART: TX, RX

### Nets
GND: C10.2 C21.2 C27.2 U3.3(GND)
VIO: C10.1 C21.1 C27.1 U2.A3(IO_VDD_1) U2.B1(IO_VDD_3) U3.5(VCC)
EN_1V8: U2.B3(GPIO_10) ; port EN_1V8
EN_1V8_GAP: U2.A5(GPIO_46) ; port EN_1V8_GAP
FPGA_PWR_NEG_HV: U2.A38(GPIO_52) ; port FPGA_PWR_NEG_HV
FPGA_PWR_POS_HV: U2.A40(GPIO_56) ; port FPGA_PWR_POS_HV
GAP_GPIO_0: U2.B7(GPIO_48) ; port GAP_GPIO_0
GAP_GPIO_1: U2.A7(GPIO_47) ; port GAP_GPIO_1
GAP_GPIO_2: U2.B6(GPIO_49) ; port GAP_GPIO_2
GAP_GPIO_3: U2.A6(GPIO_50) ; port GAP_GPIO_3
LED_G: U2.B20(GPIO_6) ; port LED_G
LED_R: U2.B19(GPIO_7) ; port LED_R
SPI_FPGA_CS: R33.1 U2.B35(GPIO_53)
SPI_FPGA_MISO: R32.1 U2.A1(GPIO_26)
SPI_FPGA_MOSI: R31.1 U2.B39(GPIO_27)
SPI_FPGA_SCLK: R35.1 U2.B40(GPIO_25)
SPI_FPGA_SCLK_BUF: R4.2 R34.2 ; port SPI_FPGA.SCLK
SPI_GAP_CS: U2.A21(GPIO_9) ; port SPI_GAP.CS
SPI_GAP_MISO: U2.A4(GPIO_12) ; port SPI_GAP.MISO
SPI_GAP_MOSI: U2.B4(GPIO_11) ; port SPI_GAP.MOSI
SPI_GAP_SCLK: U2.A20(GPIO_8) ; port SPI_GAP.SCLK
UART_GAP_RX: U2.A39(GPIO_54) ; port UART_GAP.RX
UART_GAP_TX: U2.B36(GPIO_55) ; port UART_GAP.TX
NetJ1_02: R33.2 ; port SPI_FPGA.CS
NetJ1_04: R32.2 ; port SPI_FPGA.MISO
NetJ1_08: R31.2 ; port SPI_FPGA.MOSI
NetR4_1: R4.1 R35.2 U3.2(A)
NetR34_1: R34.1 U3.4(Y)

Not connected (* = marked no-connect by the designer): U2 A41(GPIO_15)* A42(GPIO_30)* A43(GPIO_29)* A44(GPIO_28)* B5(GPIO_51)* B37(GPIO_57)*; U3 1(NC)*

### Layout directives
net class SPI_GAP: (no net found under the mark)
net class SPI_FPGA: (no net found under the mark), NetR4_1

### Notes on the sheet
- In ISP mode, UART on
  GPIO_8 (RX) and GPIO_9 (TX)
  Can be used
- Instance 1
- Instance 0
- SPI termination resistors @{"Id":"MOFVCFYU\CIFQJTYA","ObjectType":2}, @{"Id":"MOFVCFYU\RHDNGYIO","ObjectType":2}, @{"Id":"MOFVCFYU\LFCSBBRN","ObjectType":2}, @{"Id":"MOFVCFYU\MSOTHAYT","ObjectType":2}, @{"Id":"MOFVCFYU\BWGEUAMD","ObjectType":2}
  See: https://resources.altium.com/de/p/there-spi-trace-impedance-requirement
  Place master resistors @{"Id":"MOFVCFYU\CIFQJTYA","ObjectType":2}, @{"Id":"MOFVCFYU\LFCSBBRN","ObjectType":2}, @{"Id":"MOFVCFYU\BWGEUAMD","ObjectType":2} close to the SOC
  Place slave resistor @{"Id":"MOFVCFYU\RHDNGYIO","ObjectType":2} close to the connector
  Place clock buffer resistor @{"Id":"MOFVCFYU\MSOTHAYT","ObjectType":2} close to the buffer
- GPIO28 to GPIO30 cannot be used as default GPIOs as they dont have PAD drivers
  - this is why CS for GSPI is rerouted to GPIO_53 as it has to be controllable
  GPIO12 & GPIO15 aren't connected on BRD4338.
  - GPIO12 is verified to work via oscilloscope
  - GPIO15 can't be tested and is left unused
- Project:
- Laboratory:
- Date:
- File:
- Rev:
- Variation:
- Drawn By:
- Checked By:
- Sheet:
- /

### Library data of the parts
C10 C21 C27 = CMP-06035-014200-1: as C50 on sheet power_conversion
R4 = CMP-009-00004-5: as R9 on sheet debug_interface; Max Operating Temperature: 155°C; Pins: 2; RoHS Compliant: True; Min Operating Temperature: -55°C; Mounting Technology: SM; Case/Package: 0402
R31-R35 = CMP-2002-07520-1: Manufacturer: Yageo / Phycomp; Part Number: RC0402FR-0722RL
U2 = SIWG917
U3 = NC7SV17P5X: Buffer, Non-Inverting 1 Element 1 Bit per Element Push-Pull Output SC-70-5; MF: {'manufacturer': u'ON Semiconductor'}; Package: None; Price: None; Value: *; MP: NC7SV17P5X; Availability: Unavailable

## Sheet io_b.SchDoc: I/O bank B
size A4; SheetNumber: 10; SheetTotal: 11
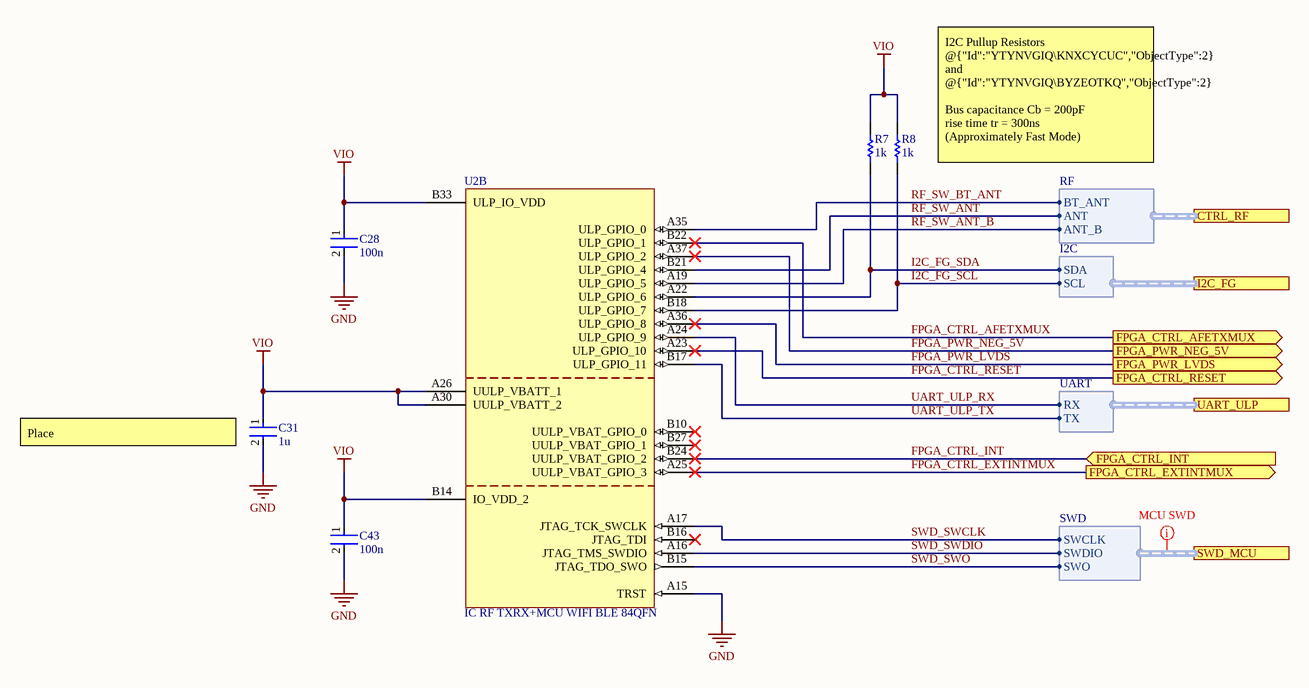
[diagram p6: io_b.SchDoc]

### Parts
C28  100n  [FP-GRT155-0_05-MFG]
C31  1u  [FP-GRM155-0_05-MFG]
C43  100n  [FP-GRT155-0_05-MFG]
R7  1k  [RESC1005X40X25LL05T10]
R8  1k  [RESC1005X40X25LL05T10]
U2  IC RF TXRX+MCU WIFI BLE 84QFN  [SIWG917M110LGTBA]  (part B of 4)

### Ports
CTRL_RF (harness RF, see power_io[6C], rf_clocks[1C]), FPGA_CTRL_AFETXMUX (out, see power_io[6C]), FPGA_CTRL_EXTINTMUX (out, see power_io[6C]), FPGA_CTRL_INT (in, see power_io[6C]), FPGA_CTRL_RESET (out, see power_io[6C]), FPGA_PWR_LVDS (out, see power_io[6C]), FPGA_PWR_NEG_5V (out, see power_io[6C]), I2C_FG (harness I2C, see power_io[6C], connectors[2B], power_conversion[1A], power_io[6C]), SWD_MCU (harness SWD, see power_io[6C], debug_interface[3B], power_io[6C]), UART_ULP (harness UART, see power_io[6C], debug_interface[3B], power_io[6C])

### Harnesses
I2C: SDA, SCL
RF: BT_ANT, ANT, ANT_B
UART: RX, TX
SWD: SWCLK, SWDIO, SWO

### Nets
GND: C28.2 C31.2 C43.2 U2.A15(TRST)
VIO: C28.1 C31.1 C43.1 R7.2 R8.2 U2.A26(UULP_VBATT_1) U2.A30(UULP_VBATT_2) U2.B14(IO_VDD_2) U2.B33(ULP_IO_VDD)
FPGA_CTRL_AFETXMUX: U2.B22(ULP_GPIO_1) ; port FPGA_CTRL_AFETXMUX
FPGA_CTRL_EXTINTMUX: U2.A25(UULP_VBAT_GPIO_3) ; port FPGA_CTRL_EXTINTMUX
FPGA_CTRL_INT: U2.B24(UULP_VBAT_GPIO_2) ; port FPGA_CTRL_INT
FPGA_CTRL_RESET: U2.A23(ULP_GPIO_10) ; port FPGA_CTRL_RESET
FPGA_PWR_LVDS: U2.A36(ULP_GPIO_8) ; port FPGA_PWR_LVDS
FPGA_PWR_NEG_5V: U2.A37(ULP_GPIO_2) ; port FPGA_PWR_NEG_5V
I2C_FG_SCL: R8.1 U2.B18(ULP_GPIO_7) ; port I2C_FG.SCL
I2C_FG_SDA: R7.1 U2.A22(ULP_GPIO_6) ; port I2C_FG.SDA
RF_SW_ANT: U2.B21(ULP_GPIO_4) ; port CTRL_RF.ANT
RF_SW_ANT_B: U2.A19(ULP_GPIO_5) ; port CTRL_RF.ANT_B
RF_SW_BT_ANT: U2.A35(ULP_GPIO_0) ; port CTRL_RF.BT_ANT
SWD_SWCLK: U2.A17(JTAG_TCK_SWCLK) ; port SWD_MCU.SWCLK
SWD_SWDIO: U2.A16(JTAG_TMS_SWDIO) ; port SWD_MCU.SWDIO
SWD_SWO: U2.B15(JTAG_TDO_SWO) ; port SWD_MCU.SWO
UART_ULP_RX: U2.A24(ULP_GPIO_9) ; port UART_ULP.RX
UART_ULP_TX: U2.B17(ULP_GPIO_11) ; port UART_ULP.TX

Not connected (* = marked no-connect by the designer): U2 B10(UULP_VBAT_GPIO_0)* B16(JTAG_TDI)* B27(UULP_VBAT_GPIO_1)*

### Layout directives
net class SWD_MCU: (no net found under the mark)

### Notes on the sheet
- (near R8) I2C Pullup Resistors @{"Id":"YTYNVGIQ\KNXCYCUC","ObjectType":2} and @{"Id":"YTYNVGIQ\BYZEOTKQ","ObjectType":2}
  Bus capacitance Cb = 200pF
  rise time tr = 300ns
  (Approximately Fast Mode)
  Pullup resistance Rp
  min = 720Ohm
  max = 1770Ohm
- (near C31) Place @{"Id":"YTYNVGIQ\TQWKBKJS","ObjectType":2} close to UULP_VBATT_2
- Project:
- Laboratory:
- Date:
- File:
- Rev:
- Variation:
- Drawn By:
- Checked By:
- Sheet:
- /

### Library data of the parts
C28 C43 = CMP-06035-014200-1: as C50 on sheet power_conversion
C31 = CMP-06035-025126-1: as C29 on sheet power_rf; Thickness: 500um; Voltage Rating (DC): 16V; Tolerance: 10%; Width: 500um; Length: 1mm; Dielectric: X6S
R7 R8 = CMP-2002-07865-1: Manufacturer: Yageo; Part Number: RC0402FR-131KL
U2 = SIWG917

## Nets that join several sheets
1V8_SW: gap (10 pins), power_conversion (U6.A1)
3V3: debug_interface (D1.1 D1.3), power_conversion (FB1.2 R21.1), power_rf (C36.1 C37.1 U2.B8)
GND: connectors (J1.09 J1.11 J1.13 J2.2), debug_interface (5 pins), gap (18 pins), power_conversion (19 pins), power_rf (13 pins), io_a (C10.2 C21.2 C27.2 U3.3), io_b (C28.2 C31.2 C43.2 U2.A15)
VBAT: connectors (J2.1), power_conversion (C51.1 IC1.A1 IC1.A2)
VBUS: connectors (J1.01 J1.03 J1.05), power_conversion (R19.2)
VIO: debug_interface (R5.2 R9.2), power_conversion (R12.1 R19.1 R21.2), power_rf (R1.1), io_a (6 pins), io_b (9 pins)
EN_1V8: power_conversion (R30.1), io_a (U2.B3)
EN_1V8_GAP: power_conversion (R20.2 U6.B2), io_a (U2.A5)
GAP_GPIO_0: gap (J3.52), io_a (U2.B7)
GAP_GPIO_1: gap (J3.54), io_a (U2.A7)
GAP_GPIO_2: gap (J3.56), io_a (U2.B6)
GAP_GPIO_3: gap (J3.58), io_a (U2.A6)
I2C_FG_SCL: connectors (J1.12), power_conversion (IC1.B1), io_b (R8.1 U2.B18)
I2C_FG_SDA: connectors (J1.07), power_conversion (IC1.C1), io_b (R7.1 U2.A22)
LED_G: debug_interface (R11.1), io_a (U2.B20)
LED_R: debug_interface (R10.1), io_a (U2.B19)
NetJ1_02: connectors (J1.02), io_a (R33.2)
NetJ1_04: connectors (J1.04), io_a (R32.2)
NetJ1_08: connectors (J1.08), io_a (R31.2)
SPI_FPGA_SCLK_BUF: connectors (J1.06), io_a (R4.2 R34.2)
SPI_GAP_CS: gap (J3.48), io_a (U2.A21)
SPI_GAP_MISO: gap (J3.44), io_a (U2.A4)
SPI_GAP_MOSI: gap (J3.42), io_a (U2.B4)
SPI_GAP_SCLK: gap (J3.40), io_a (U2.A20)
SWD_SWCLK: debug_interface (PJ1.3), io_b (U2.A17)
SWD_SWDIO: debug_interface (PJ1.4), io_b (U2.A16)
SWD_SWO: debug_interface (PJ1.5 SW2.2), io_b (U2.B15)
UART_GAP_RX: gap (J3.71), io_a (U2.A39)
UART_GAP_TX: gap (J3.69), io_a (U2.B36)
UART_ULP_RX: debug_interface (PJ1.7), io_b (U2.A24)
UART_ULP_TX: debug_interface (PJ1.6), io_b (U2.B17)

## Assembly variants
mcu_1v8_from_tinyprobe: not fitted C27 C39 C39 C40 C40 C53 C54 R12 R21 R23 R25 R28 R34 R35 U3
all_1v8: not fitted C27 C39 C39 C40 C40 C53 C54 R19 R21 R23 R25 R34 R35 R? U3